# Altium schematic sheet Motor_Driver_2.SchDoc
size A4; DocumentNumber: 5; SheetNumber: 4; SheetTotal: 6
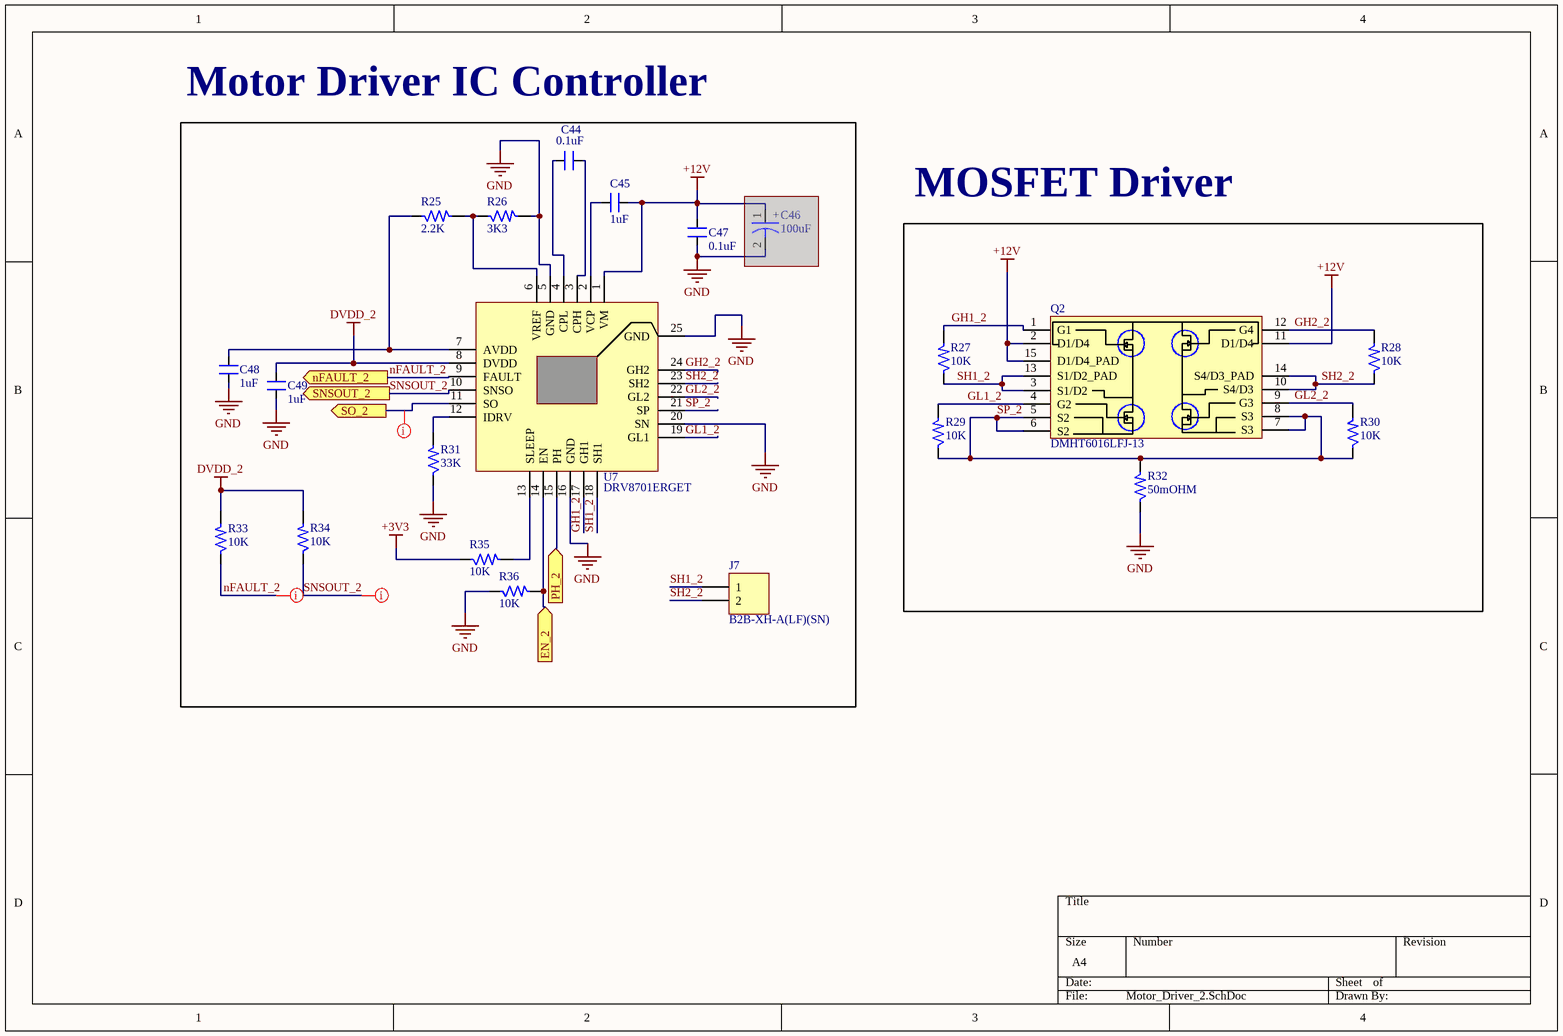
[diagram p0: Motor_Driver_2.SchDoc]

## Parts
C44  0.1uF  [CAP_0805]
C45  1uF  [CAP_0805]
C46  100uF  [ACAP_P305_D393_H393_RAD]  (masked out: inside a compile mask, not in the netlist)
C47  0.1uF  [CAP_0805]
C48  1uF  [CAP_0805]
C49  1uF  [CAP_0805]
J7  B2B-XH-A(LF)(SN)  [CON2_100_B2B-XH-A_TH_ST]
Q2  DMHT6016LFJ-13  [DFN5045-12_33_212_27X15_SMD_1]
R25  2.2K  [RES_0603]
R26  3K3  [RES_0603]
R27  10K  [RES_0603]
R28  10K  [RES_0603]
R29  10K  [RES_0603]
R30  10K  [RES_0603]
R31  33K  [RES_0805]
R32  50mOHM  [RES_2512]
R33  10K  [RES_0603]
R34  10K  [RES_0603]
R35  10K  [RES_0603]
R36  10K  [RES_0603]
U7  DRV8701ERGET  [VFQFN24_19.6_196_12X32_SMD_1]

## Blocks framed on the sheet
Motor Driver IC Controller: C44-C49 J7 R25 R26 R31 R33-R36 U7
MOSFET Driver: Q2 R27-R30 R32

## Ports
EN_2 (in, see MCU_STM32F407[5B]), nFAULT_2 (out, see MCU_STM32F407[7B]), PH_2 (in, see MCU_STM32F407[7B]), SNSOUT_2 (out, see MCU_STM32F407[7B]), SO_2 (out, see MCU_STM32F407[5A])

## Nets
+3V3: R35.1
+12V: C45.1 C47.2 Q2.2(D1/D4) Q2.11(D1/D4) Q2.15(D1/D4_PAD) U7.1(VM)
DVDD_2: C49.2 R33.2 R34.2 U7.8(DVDD)
GND: C47.1 C48.1 C49.1 R26.2 R31.1 R32.1 R36.1 U7.5(GND) U7.16(GND) U7.20(SN) U7.25(GND)
EN_2: R36.2 U7.14(EN) ; port EN_2
GH1_2: Q2.1(G1) R27.2 U7.17(GH1)
GH2_2: Q2.12(G4) R28.2 U7.24(GH2)
GL1_2: Q2.4(G2) R29.2 U7.19(GL1)
GL2_2: Q2.9(G3) R30.2 U7.22(GL2)
nFAULT_2: R33.1 U7.9(FAULT) ; port nFAULT_2
PH_2: U7.15(PH) ; port PH_2
SH1_2: J7.1 Q2.3(S1/D2) Q2.13(S1/D2_PAD) R27.1 U7.18(SH1)
SH2_2: J7.2 Q2.10(S4/D3) Q2.14(S4/D3_PAD) R28.1 U7.23(SH2)
SNSOUT_2: R34.1 U7.10(SNSO) ; port SNSOUT_2
SO_2: U7.11(SO) ; port SO_2
SP_2: Q2.5(S2) Q2.6(S2) Q2.7(S3) Q2.8(S3) R29.1 R30.1 R32.2 U7.21(SP)
NetC44_1: C44.1 U7.3(CPH)
NetC44_2: C44.2 U7.4(CPL)
NetC45_2: C45.2 U7.2(VCP)
NetC48_2: C48.2 R25.1 U7.7(AVDD)
NetR25_2: R25.2 R26.1 U7.6(VREF)
NetR31_2: R31.2 U7.12(IDRV)
NetR35_2: R35.2 U7.13(SLEEP)

## Layout directives
net class Critical Nets: nFAULT_2, SNSOUT_2, SO_2

## Notes on the sheet
- (in symbol CAP-P_100uF-50V-20%-RAD) +

## Library data of the parts
C44 C47 = CAP_0.1uF-50V-10%-0805: 0.1µF ±10% 50V Ceramic Capacitor X7R 0805 (2012 Metric); Manufacturer: Samsung; Manufacturer Part Number: CL21B104KBCNNNC; Alternate Part Number-1: NA; Case/Package: 0805; Supplier-1: SIRICOM; Supplier Part Number-1: 0805B104K500CT
C45 C48 C49 = CAP_1uF-50V-5%-0805: 1µF ±5% 50V Ceramic Capacitor X7R 0805 (2012 Metric); Manufacturer: Samsung; Manufacturer Part Number: CC0805JKX7R9BB105; Alternate Part Number-1: 0805F105M500NT; Case/Package: 0805; Supplier-1: SIRICOM; Supplier Part Number-1: CL21B105KBFNNNE
C46 = CAP-P_100uF-50V-20%-RAD: 100µF 50V Aluminum Polymer Capacitor Radial, Can - SMD 28mOhm 4000 Hrs @ 125°C; Manufacturer: Nichicon; Manufacturer Part Number: GYA1H101MCQ1GS; Alternate Part Number-1: VEU101M1HTR-1010; Case/Package: Radial-SMD; Supplier-1: SP ROAD; Supplier Part Number-1: GYA1H101MCQ1GS
J7 = CON-PLG_2X1-100-ST-TH: 2 Pins, 1 Row 2.54mm Pitch, Straight Connector, male; Manufacturer: JST; Mating Part Number: XHP-2; Crimp Part Number: ASXHSXH22K51; Alternate Part Number-1: NA; Manufacturer Part Number: B2B-XH-A(LF)(SN); Case/Package: TH-CON; Supplier-1: SP ROAD; Supplier Part Number-1: B2B-XH-A(LF)(SN)
Q2 = MOSFET-N_60V-14.8A-V-DFN5045-12: Mosfet Array 4 N-Channel 14.8A (Ta) Surface Mount V-DFN5045-12; Manufacturer: ON Semiconductor; Alternate Part Number-1: DMHT3006LFJ-13; Manufacturer Part Number: DMHT6016LFJ-13; Case/Package: DFN5045-12; Supplier-1: LCSC; Supplier Part Number-1: C460986
R25 = RES_2.2K-0.1W-1%-0603: 2.2 kOhms ±1% 0.1W, 1/10W Chip Resistor 0603 (1608 Metric) Automotive AEC-Q200 Thick Film; Manufacturer: Walsin; Manufacturer Part Number: WR06X2201FTL; Case/Package: 0603; Supplier-1: SIRICOM; Supplier Part Number-1: WR06X2201FTL; Alternate Part Number-1: WR06X2201FTL
R26 = RES_3.3K-0.1W-1%-0603: 3.3 kOhms ±1% 0.1W, 1/10W Chip Resistor 0603 (1608 Metric) Automotive AEC-Q200 Thick Film; Manufacturer: Wilson; Manufacturer Part Number: WR06X3301FTL; Alternate Part Number-1: 0603WAF3301T5E; Case/Package: 0603; Supplier-1: SIRICOM; Supplier Part Number-1: WR06X3301FTL
R27-R30 R33-R36 = RES_10K-0.1W-1%-0603: 10 kOhms ±1% 0.1W, 1/10W Chip Resistor 0603 (1608 Metric) Automotive AEC-Q200 Thick Film; Manufacturer: Walsin; Manufacturer Part Number: WR06X1002FTL; Alternate Part Number-1: 0603WAJ0103T5E; Case/Package: 0603; Supplier-1: SIRICOM; Supplier Part Number-1: WR06X1002FTL
R31 = RES_33K-0.125W-1%-0805: Thick Film Resistors - SMD 33KOhms 1/8W 150V33 kOhms ±1% 0.125W, 1/8W Chip Resistor 0805 (2012 Metric) Thick Film; Manufacturer: Vishay BCcomponents; Manufacturer Part Number: CRG0805F33K; Alternate Part Number-1: NA; Case/Package: 0805; Supplier-1: SIRICOM; Supplier Part Number-1: WR08X3302FTL
R32 = RES_50mOhm-2W-1%-2512: 50 mOhms ±1% 2W Chip Resistor 2512 (6432 Metric) Automotive AEC-Q200, Current Sense, Moisture Resistant Metal Element; Manufacturer: Yageo; Manufacturer Part Number: PA2512FKF7W0R05E; Alternate Part Number-1: PMR100HZPFU5L00; Case/Package: 2512; Supplier-1: SIRICOM; Supplier Part Number-1: LR2512-22R060F1
U7 = IC_DRV8701ERGET: Motor Driver Power MOSFET Parallel 24-VQFN (4x4); Manufacturer: Texas Instruments; Alternate Part Number-1: NA; Manufacturer Part Number: DRV8701ERGET; Case/Package: VFQFN24; Supplier-1: ARROW; Supplier Part Number-1: DRV8701ERGET